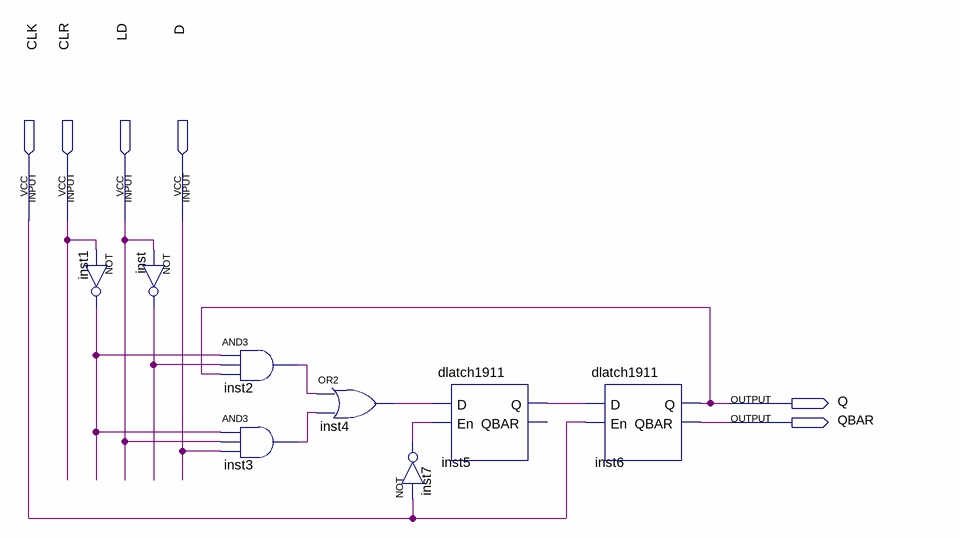
[diagram p0: schematic sheet]
// Quartus schematic dff1911.bdf as structural Verilog: 8 symbols, 6 pins
module dff1911 (
  input  CLK,
  input  CLR,
  input  LD,
  input  D,
  output Q,
  output QBAR
);

  wire inst1_out, inst2_out, inst3_out, inst4_out, inst5_q, inst7_out, inst_out;

  not inst1 (inst1_out, CLR);
  not inst (inst_out, LD);
  and inst2 (inst2_out, inst1_out, inst_out, Q);
  and inst3 (inst3_out, inst1_out, LD, D);
  or inst4 (inst4_out, inst2_out, inst3_out);
  dlatch1911 inst5 (.D(inst4_out), .En(inst7_out), .Q(inst5_q));  // open: QBAR
  not inst7 (inst7_out, CLK);
  dlatch1911 inst6 (.D(inst5_q), .En(CLK), .Q(Q), .QBAR(QBAR));
endmodule
